# Altium project UPDATE.PrjPcb
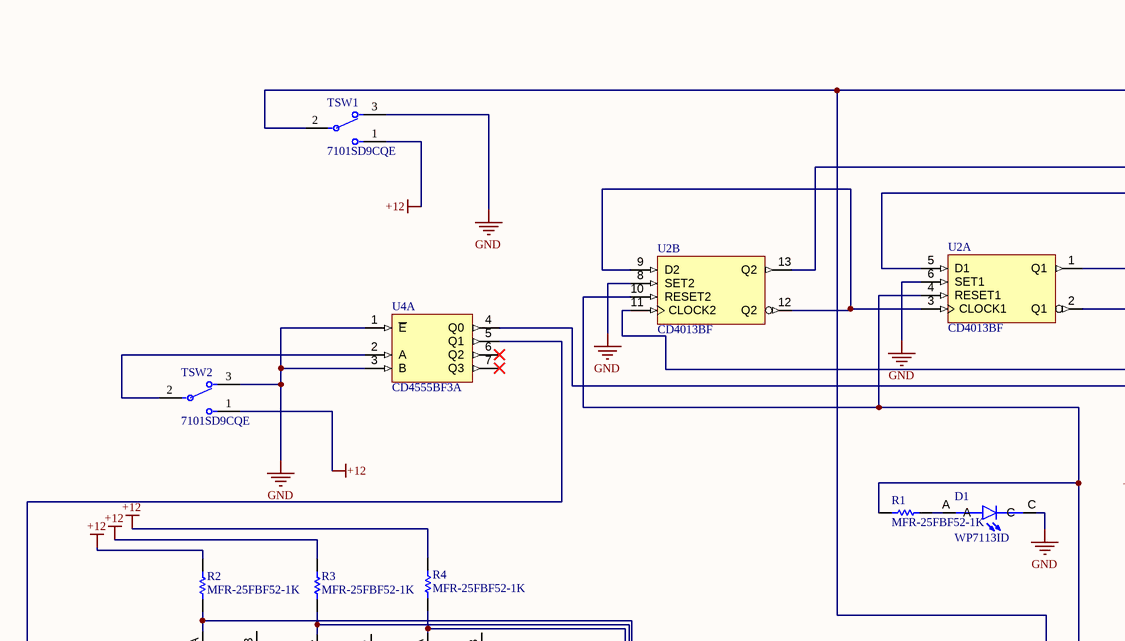
[diagram p0: Sheet2.SchDoc, centre column 2 of 4]
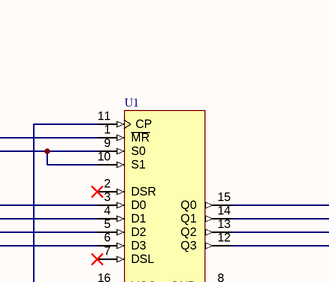
[diagram p1: Sheet2.SchDoc, centre column 3 of 4]
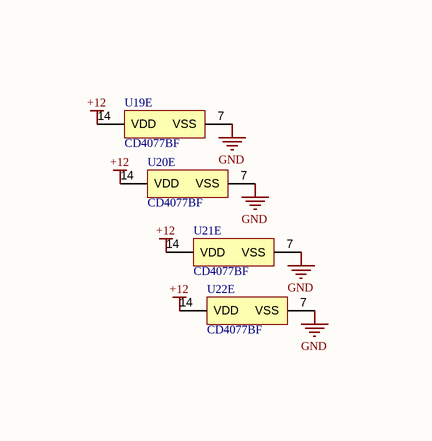
[diagram p2: Sheet2.SchDoc, centre column 4 of 4]
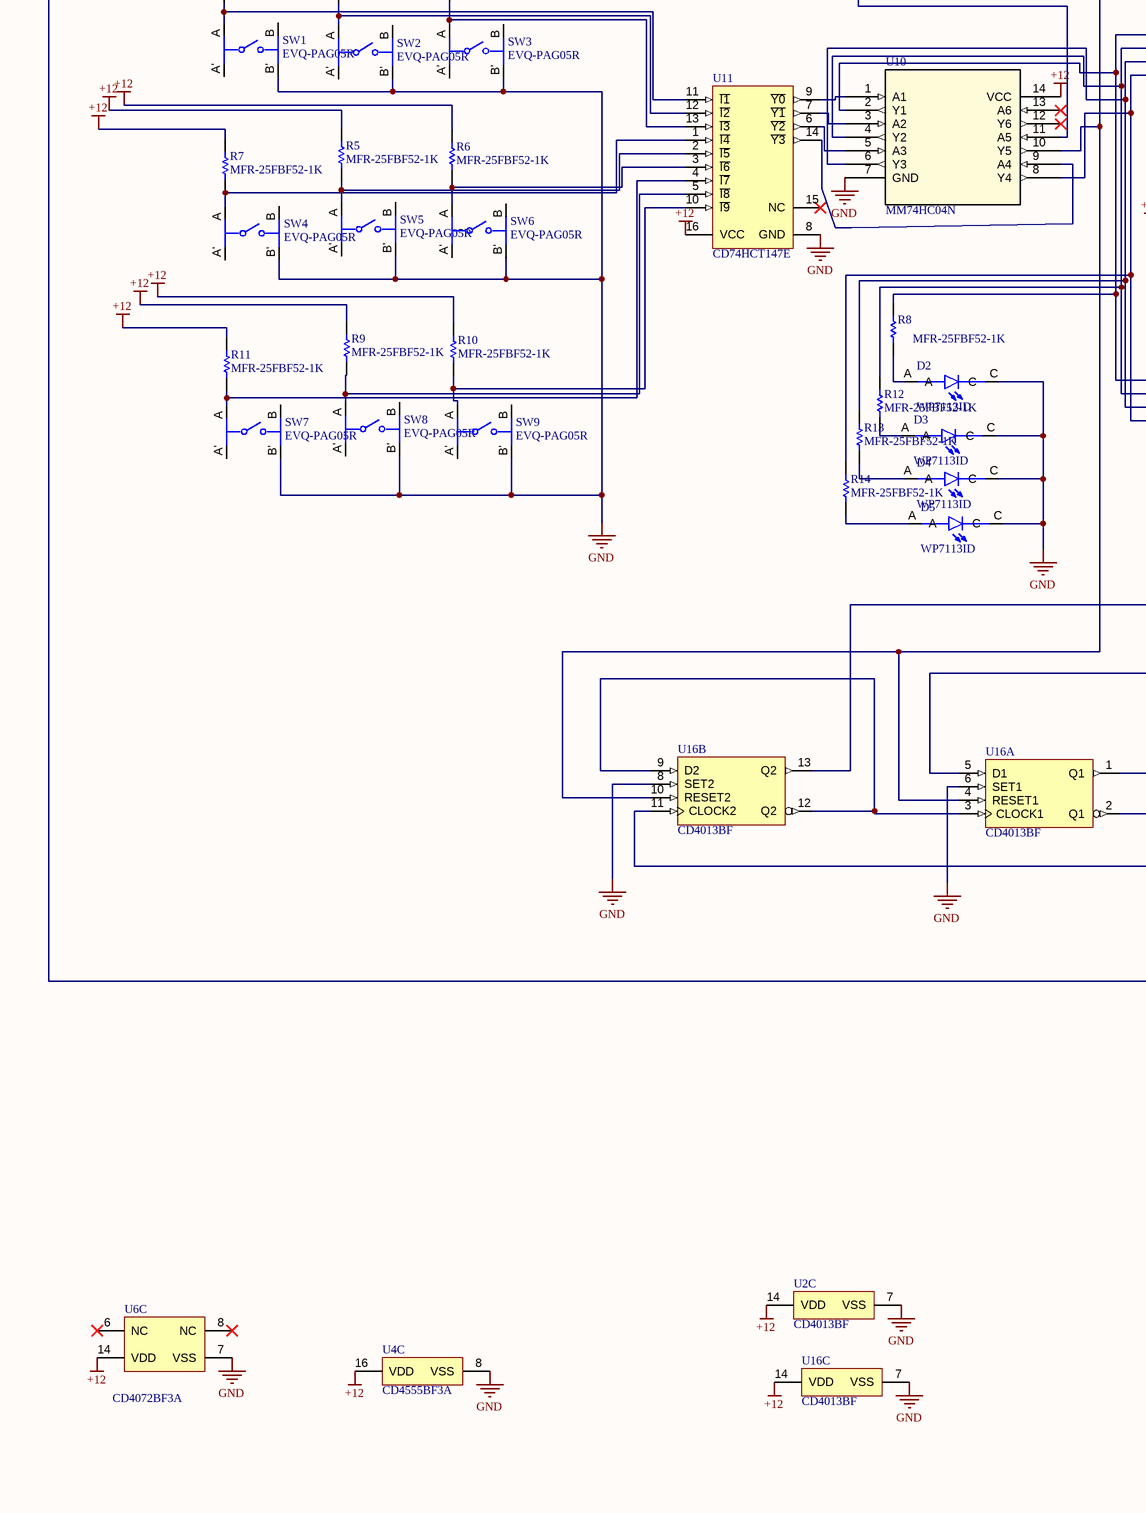
[diagram p3: Sheet2.SchDoc, bottom column 2 of 4]
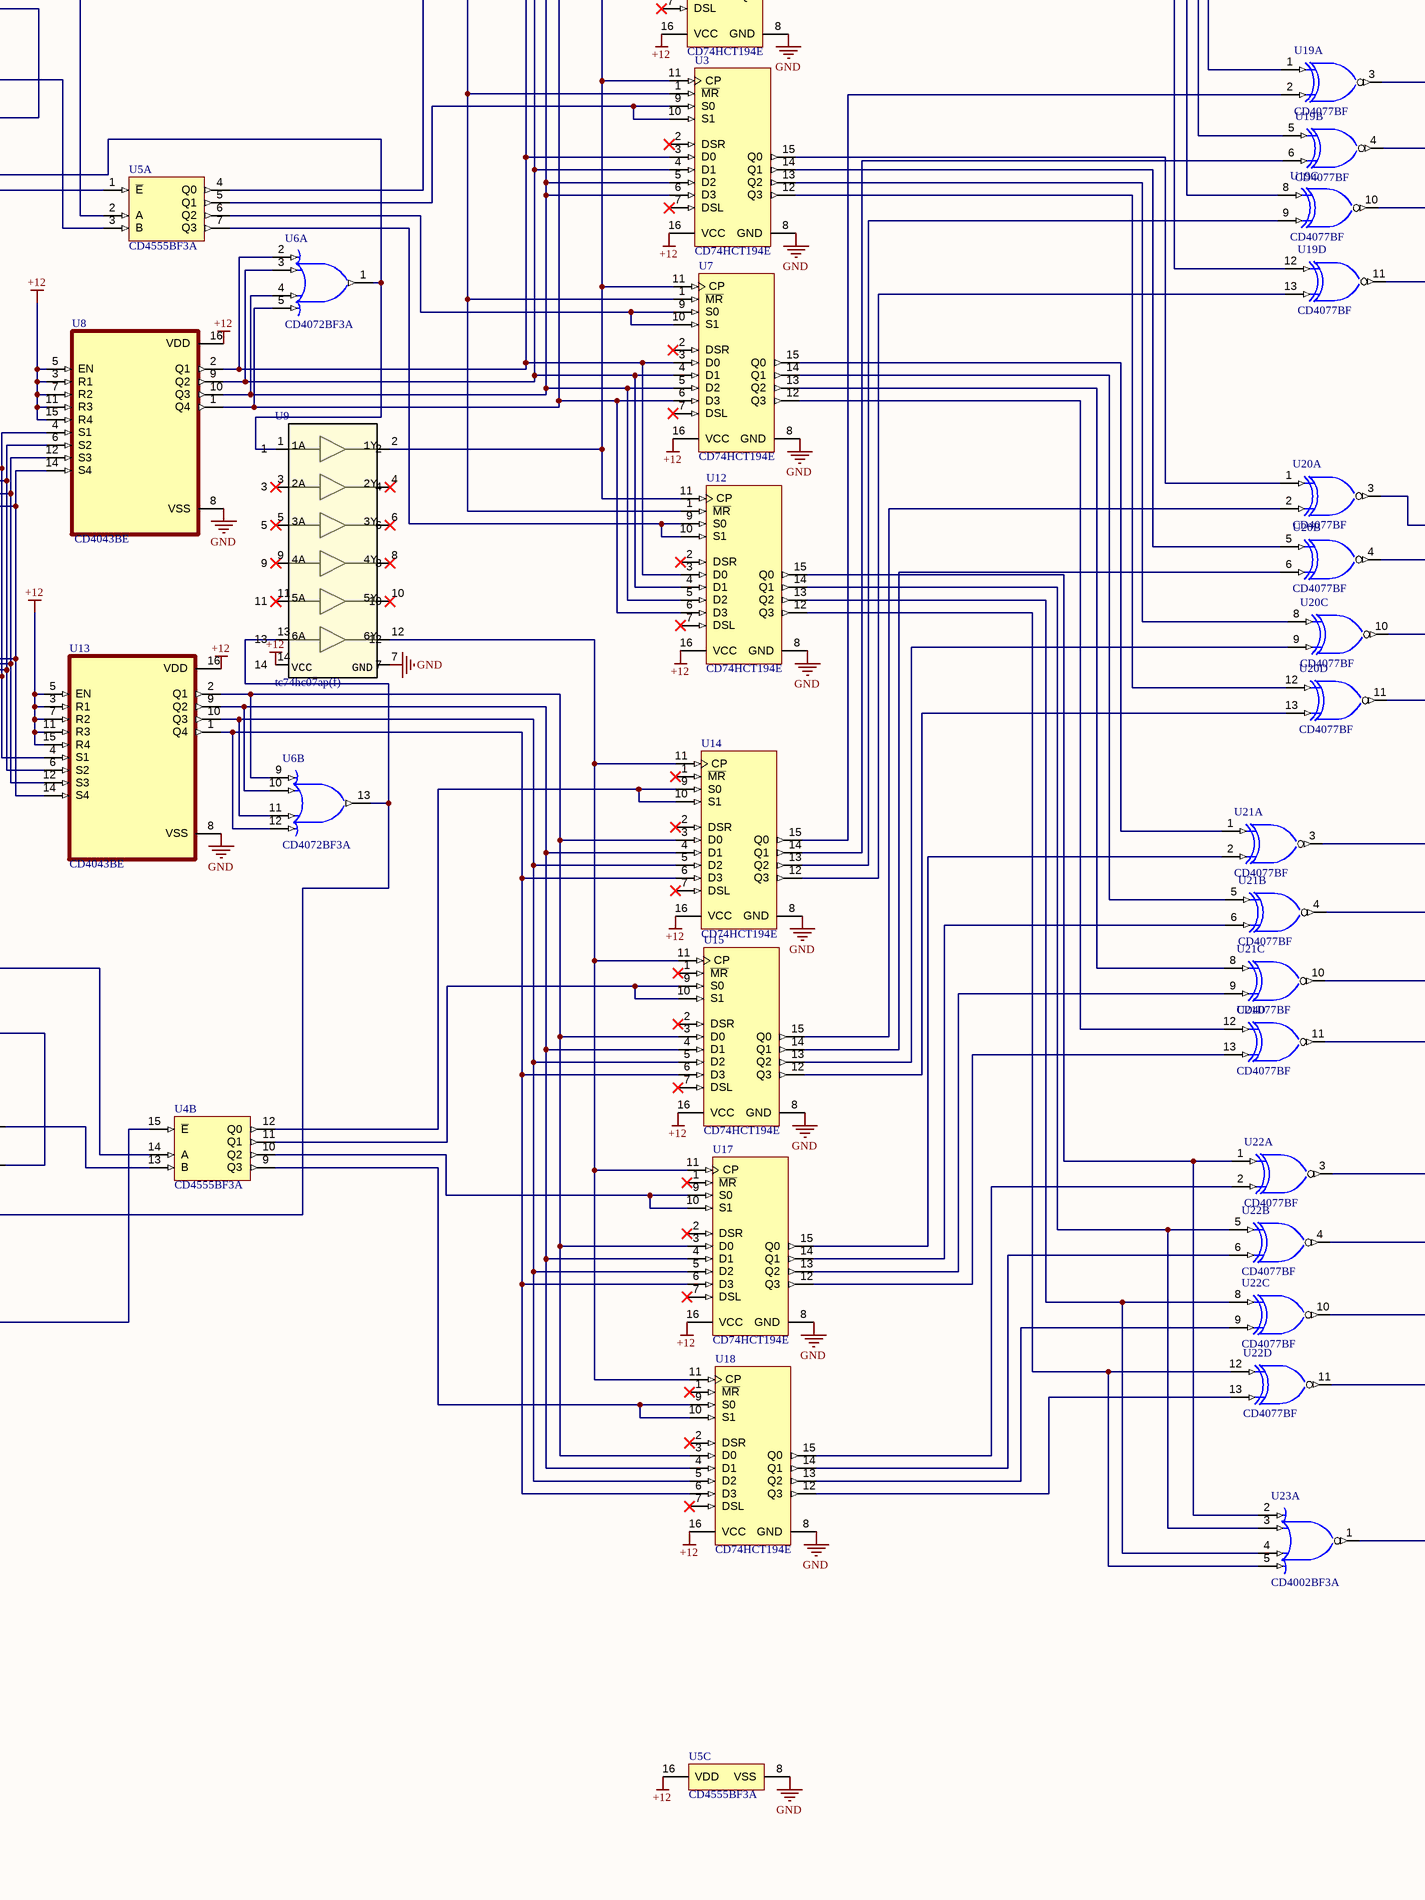
[diagram p4: Sheet2.SchDoc, bottom column 3 of 4]
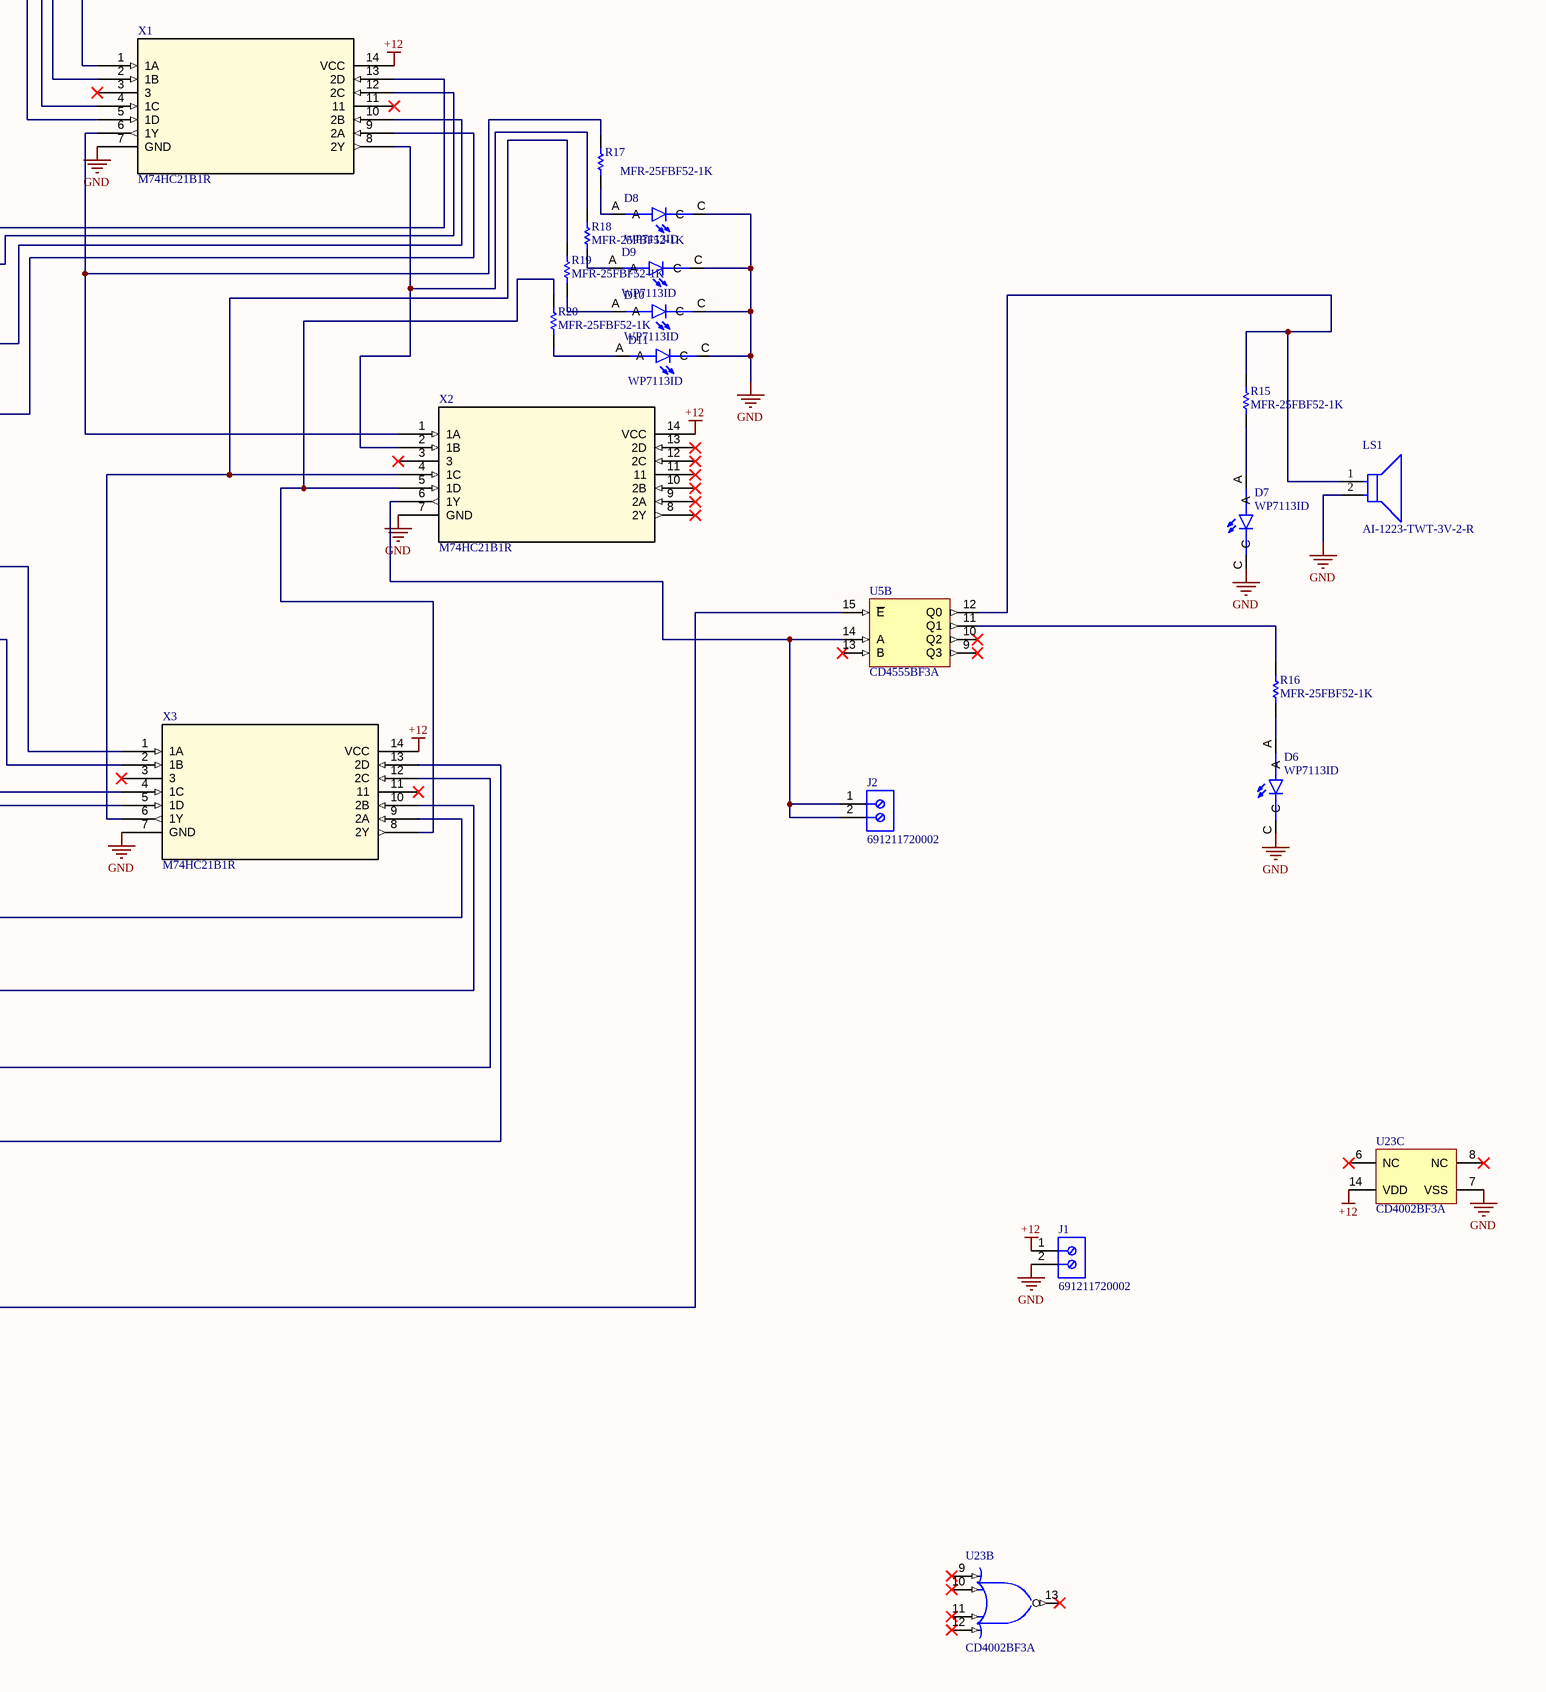
[diagram p5: Sheet2.SchDoc, bottom column 4 of 4]
1 sheet, 71 parts. Net scope: global (net labels, ports and power ports of the same name join across sheets).
Board file: PCB1.PcbDoc

## Sheet Sheet2.SchDoc
size 863 x 558 mm; SheetNumber: 1; SheetTotal: 1

### Parts
D1  WP7113ID  [LED_WP7113ID]
D2  WP7113ID  [LED_WP7113ID]
D3  WP7113ID  [LED_WP7113ID]
D4  WP7113ID  [LED_WP7113ID]
D5  WP7113ID  [LED_WP7113ID]
D6  WP7113ID  [LED_WP7113ID]
D7  WP7113ID  [LED_WP7113ID]
D8  WP7113ID  [LED_WP7113ID]
D9  WP7113ID  [LED_WP7113ID]
D10  WP7113ID  [LED_WP7113ID]
D11  WP7113ID  [LED_WP7113ID]
J1  691211720002  [691211720002]
J2  691211720002  [691211720002]
LS1  AI-1223-TWT-3V-2-R  [FP-AI-1223-TWT-3V-2-R-MFG]
R1  MFR-25FBF52-1K  [RESA60-630X240]
R2  MFR-25FBF52-1K  [RESA60-630X240]
R3  MFR-25FBF52-1K  [RESA60-630X240]
R4  MFR-25FBF52-1K  [RESA60-630X240]
R5  MFR-25FBF52-1K  [RESA60-630X240]
R6  MFR-25FBF52-1K  [RESA60-630X240]
R7  MFR-25FBF52-1K  [RESA60-630X240]
R8  MFR-25FBF52-1K  [RESA60-630X240]
R9  MFR-25FBF52-1K  [RESA60-630X240]
R10  MFR-25FBF52-1K  [RESA60-630X240]
R11  MFR-25FBF52-1K  [RESA60-630X240]
R12  MFR-25FBF52-1K  [RESA60-630X240]
R13  MFR-25FBF52-1K  [RESA60-630X240]
R14  MFR-25FBF52-1K  [RESA60-630X240]
R15  MFR-25FBF52-1K  [RESA60-630X240]
R16  MFR-25FBF52-1K  [RESA60-630X240]
R17  MFR-25FBF52-1K  [RESA60-630X240]
R18  MFR-25FBF52-1K  [RESA60-630X240]
R19  MFR-25FBF52-1K  [RESA60-630X240]
R20  MFR-25FBF52-1K  [RESA60-630X240]
SW1  EVQ-PAG05R  [FP-EVQ-PAG05R-MFG]
SW2  EVQ-PAG05R  [FP-EVQ-PAG05R-MFG]
SW3  EVQ-PAG05R  [FP-EVQ-PAG05R-MFG]
SW4  EVQ-PAG05R  [FP-EVQ-PAG05R-MFG]
SW5  EVQ-PAG05R  [FP-EVQ-PAG05R-MFG]
SW6  EVQ-PAG05R  [FP-EVQ-PAG05R-MFG]
SW7  EVQ-PAG05R  [FP-EVQ-PAG05R-MFG]
SW8  EVQ-PAG05R  [FP-EVQ-PAG05R-MFG]
SW9  EVQ-PAG05R  [FP-EVQ-PAG05R-MFG]
TSW1  7101SD9CQE  [FP-7101SD9CQE-MFG]
TSW2  7101SD9CQE  [FP-7101SD9CQE-MFG]
U1  CD74HCT194E  [N0016A]
U2  CD4013BF  [J0014A]  (parts A,B,C of 3)
U3  CD74HCT194E  [N0016A]
U4  CD4555BF3A  [J0016A]  (parts A,B,C of 3)
U5  CD4555BF3A  [J0016A]  (parts A,B,C of 3)
U6  CD4072BF3A  [J0014A]  (parts A,B,C of 3)
U7  CD74HCT194E  [N0016A]
U8  CD4043BE  [DIP794W45P254L1969H508Q16]
U9  tc74hc07ap(f)  [DIP14_TOS]
U10  MM74HC04N  [PDIP14_19P56X6P35_ONS]
U11  CD74HCT147E  [N0016A]
U12  CD74HCT194E  [N0016A]
U13  CD4043BE  [DIP794W45P254L1969H508Q16]
U14  CD74HCT194E  [N0016A]
U15  CD74HCT194E  [N0016A]
U16  CD4013BF  [J0014A]  (parts A,B,C of 3)
U17  CD74HCT194E  [N0016A]
U18  CD74HCT194E  [N0016A]
U19  CD4077BF  [J0014A]  (parts A,B,C,D,E of 5)
U20  CD4077BF  [J0014A]  (parts A,B,C,D,E of 5)
U21  CD4077BF  [J0014A]  (parts A,B,C,D,E of 5)
U22  CD4077BF  [J0014A]  (parts A,B,C,D,E of 5)
U23  CD4002BF3A  [J0014A]  (parts A,B,C of 3)
X1  M74HC21B1R  [DIP14_300_STH]
X2  M74HC21B1R  [DIP14_300_STH]
X3  M74HC21B1R  [DIP14_300_STH]

### Nets
+12: J1.1 R2.2 R3.2 R4.2 R5.2 R6.2 R7.2 R9.2 R10.2 R11.2 TSW1.1 TSW2.1 U1.16(VCC) U2.14(VDD) U3.16(VCC) U4.16(VDD) U5.16(VDD) U6.14(VDD) U7.16(VCC) U8.3(R1) U8.5(EN) U8.7(R2) U8.11(R3) U8.15(R4) U8.16(VDD) U9.14 U10.14(VCC) U11.16(VCC) U12.16(VCC) U13.3(R1) U13.5(EN) U13.7(R2) U13.11(R3) U13.15(R4) U13.16(VDD) U14.16(VCC) U15.16(VCC) U16.14(VDD) U17.16(VCC) U18.16(VCC) U19.14(VDD) U20.14(VDD) U21.14(VDD) U22.14(VDD) U23.14(VDD) X1.14(VCC) X2.14(VCC) X3.14(VCC)
GND: D1.C D2.C D3.C D4.C D5.C D6.C D7.C D8.C D9.C D10.C D11.C J1.2 LS1.2(A) SW1.B' SW2.B' SW3.B' SW4.B' SW5.B' SW6.B' SW7.B' SW8.B' SW9.B' TSW1.3 TSW2.3 U1.8(GND) U2.6(SET1) U2.7(VSS) U2.8(SET2) U3.8(GND) U4.1(~{E}) U4.3(B) U4.8(VSS) U5.8(VSS) U6.7(VSS) U7.8(GND) U8.8(VSS) U9.7 U10.7(GND) U11.8(GND) U12.8(GND) U13.8(VSS) U14.8(GND) U15.8(GND) U16.6(SET1) U16.7(VSS) U16.8(SET2) U17.8(GND) U18.8(GND) U19.7(VSS) U20.7(VSS) U21.7(VSS) U22.7(VSS) U23.7(VSS) X1.7(GND) X2.7(GND) X3.7(GND)
NetD1_A: D1.A R1.2
NetD2_A: D2.A R8.1
NetD3_A: D3.A R12.1
NetD4_A: D4.A R13.1
NetD5_A: D5.A R14.1
NetD6_A: D6.A R16.1
NetD7_A: D7.A R15.1
NetD8_A: D8.A R17.1
NetD9_A: D9.A R18.1
NetD10_A: D10.A R19.1
NetD11_A: D11.A R20.1
NetJ2_1: J2.1 J2.2 U5.14(A) X2.6(1Y)
NetLS1_1: LS1.1(C) R15.2 U5.12(Q0)
NetR1_1: R1.1 U2.4(RESET1) U2.10(RESET2) U10.10(Y5) U16.4(RESET1) U16.10(RESET2)
NetR2_1: R2.1 SW1.A U11.11(~{I1})
NetR3_1: R3.1 SW2.A U11.12(~{I2})
NetR4_1: R4.1 SW3.A U11.13(~{I3})
NetR5_1: R5.1 SW5.A U11.2(~{I5})
NetR6_1: R6.1 SW6.A U11.3(~{I6})
NetR7_1: R7.1 SW4.A U11.1(~{I4})
NetR8_2: R8.2 U8.4(S1) U10.2(Y1) U13.4(S1)
NetR9_1: R9.1 SW8.A U11.5(~{I8})
NetR10_1: R10.1 SW9.A U11.10(~{I9})
NetR11_1: R11.1 SW7.A U11.4(~{I7})
NetR12_2: R12.2 U8.6(S2) U10.4(Y2) U13.6(S2)
NetR13_2: R13.2 U8.12(S3) U10.6(Y3) U13.12(S3)
NetR14_2: R14.2 U8.14(S4) U10.8(Y4) U13.14(S4)
NetR16_2: R16.2 U5.11(Q1)
NetR17_2: R17.2 X1.6(1Y) X2.1(1A)
NetR18_2: R18.2 X1.8(2Y) X2.2(1B)
NetR19_2: R19.2 X2.4(1C) X3.6(1Y)
NetR20_2: R20.2 X2.5(1D) X3.8(2Y)
NetTSW1_2: TSW1.2(COMM) U1.1(~{MR}) U3.1(~{MR}) U7.1(~{MR}) U10.11(A5) U12.1(~{MR})
NetTSW2_2: TSW2.2(COMM) U4.2(A)
NetU1_3: U1.3(D0) U3.3(D0) U6.2(A) U7.3(D0) U8.2(Q1) U12.3(D0)
NetU1_4: U1.4(D1) U3.4(D1) U6.3(B) U7.4(D1) U8.9(Q2) U12.4(D1)
NetU1_5: U1.5(D2) U3.5(D2) U3.6(D3) U6.4(C) U7.5(D2) U8.10(Q3) U12.5(D2)
NetU1_6: U1.6(D3) U6.5(D) U7.6(D3) U8.1(Q4) U12.6(D3)
NetU1_9: U1.9(S0) U1.10(S1) U5.4(Q0)
NetU1_11: U1.11(CP) U3.11(CP) U7.11(CP) U9.2 U12.11(CP)
NetU1_12: U1.12(Q3) U19.12(G)
NetU1_13: U1.13(Q2) U19.8(E)
NetU1_14: U1.14(Q1) U19.5(C)
NetU1_15: U1.15(Q0) U19.1(A)
NetU2_1: U2.1(Q1) U5.3(B)
NetU2_2: U2.2(Q1) U2.5(D1)
NetU2_3: U2.3(CLOCK1) U2.9(D2) U2.12(Q2)
NetU2_11: U2.11(CLOCK2) U6.1(J) U9.1
NetU2_13: U2.13(Q2) U5.2(A)
NetU3_9: U3.9(S0) U3.10(S1) U5.5(Q1)
NetU3_12: U3.12(Q3) U20.12(G)
NetU3_13: U3.13(Q2) U20.8(E)
NetU3_14: U3.14(Q1) U20.5(C)
NetU3_15: U3.15(Q0) U20.1(A)
NetU4_4: U4.4(Q0) U5.1(~{E})
NetU4_5: U4.5(Q1) U4.15(~{E})
NetU4_9: U4.9(Q3) U18.9(S0) U18.10(S1)
NetU4_10: U4.10(Q2) U17.9(S0) U17.10(S1)
NetU4_11: U4.11(Q1) U15.9(S0) U15.10(S1)
NetU4_12: U4.12(Q0) U14.9(S0) U14.10(S1)
NetU4_13: U4.13(B) U16.1(Q1)
NetU4_14: U4.14(A) U16.13(Q2)
NetU5_6: U5.6(Q2) U7.9(S0) U7.10(S1)
NetU5_7: U5.7(Q3) U12.9(S0) U12.10(S1)
NetU5_15: U5.15(~{E}) U23.1(J)
NetU6_9: U6.9(E) U13.2(Q1) U14.3(D0) U15.3(D0) U17.3(D0) U18.3(D0)
NetU6_10: U6.10(F) U13.9(Q2) U14.4(D1) U15.4(D1) U17.4(D1) U18.4(D1)
NetU6_11: U6.11(G) U13.10(Q3) U14.5(D2) U15.5(D2) U17.5(D2) U18.5(D2)
NetU6_12: U6.12(H) U13.1(Q4) U14.6(D3) U15.6(D3) U17.6(D3) U18.6(D3)
NetU6_13: U6.13(K) U9.13 U16.11(CLOCK2)
NetU7_12: U7.12(Q3) U21.12(G)
NetU7_13: U7.13(Q2) U21.8(E)
NetU7_14: U7.14(Q1) U21.5(C)
NetU7_15: U7.15(Q0) U21.1(A)
NetU9_12: U9.12 U14.11(CP) U15.11(CP) U17.11(CP) U18.11(CP)
NetU10_1: U10.1(A1) U11.9(~{Y0})
NetU10_3: U10.3(A2) U11.7(~{Y1})
NetU10_5: U10.5(A3) U11.6(~{Y2})
NetU10_9: U10.9(A4) U11.14(~{Y3})
NetU12_12: U12.12(Q3) U22.12(G) U23.5(D)
NetU12_13: U12.13(Q2) U22.8(E) U23.4(C)
NetU12_14: U12.14(Q1) U22.5(C) U23.3(B)
NetU12_15: U12.15(Q0) U22.1(A) U23.2(A)
NetU14_12: U14.12(Q3) U19.13(H)
NetU14_13: U14.13(Q2) U19.9(F)
NetU14_14: U14.14(Q1) U19.6(D)
NetU14_15: U14.15(Q0) U19.2(B)
NetU15_12: U15.12(Q3) U20.13(H)
NetU15_13: U15.13(Q2) U20.9(F)
NetU15_14: U15.14(Q1) U20.6(D)
NetU15_15: U15.15(Q0) U20.2(B)
NetU16_2: U16.2(Q1) U16.5(D1)
NetU16_3: U16.3(CLOCK1) U16.9(D2) U16.12(Q2)
NetU17_12: U17.12(Q3) U21.13(H)
NetU17_13: U17.13(Q2) U21.9(F)
NetU17_14: U17.14(Q1) U21.6(D)
NetU17_15: U17.15(Q0) U21.2(B)
NetU18_12: U18.12(Q3) U22.13(H)
NetU18_13: U18.13(Q2) U22.9(F)
NetU18_14: U18.14(Q1) U22.6(D)
NetU18_15: U18.15(Q0) U22.2(B)
NetU19_3: U19.3(J) X1.1(1A)
NetU19_4: U19.4(K) X1.2(1B)
NetU19_10: U19.10(L) X1.4(1C)
NetU19_11: U19.11(M) X1.5(1D)
NetU20_3: U20.3(J) X1.13(2D)
NetU20_4: U20.4(K) X1.12(2C)
NetU20_10: U20.10(L) X1.10(2B)
NetU20_11: U20.11(M) X1.9(2A)
NetU21_3: U21.3(J) X3.1(1A)
NetU21_4: U21.4(K) X3.2(1B)
NetU21_10: U21.10(L) X3.4(1C)
NetU21_11: U21.11(M) X3.5(1D)
NetU22_3: U22.3(J) X3.9(2A)
NetU22_4: U22.4(K) X3.10(2B)
NetU22_10: U22.10(L) X3.12(2C)
NetU22_11: U22.11(M) X3.13(2D)

Not connected (* = marked no-connect by the designer): SW1 A' B; SW2 A' B; SW3 A' B; SW4 A' B; SW5 A' B; SW6 A' B; SW7 A' B; SW8 A' B; SW9 A' B; U1 2(DSR)* 7(DSL)*; U3 2(DSR)* 7(DSL)*; U4 6(Q2)* 7(Q3)*; U5 9(Q3)* 10(Q2)* 13(B)*; U6 6(NC)* 8(NC)*; U7 2(DSR)* 7(DSL)*; U9 3* 4* 5* 6* 8* 9* 10* 11*; U10 12(Y6)* 13(A6)*; U11 15(NC)*; U12 2(DSR)* 7(DSL)*; U14 1(~{MR})* 2(DSR)* 7(DSL)*; U15 1(~{MR})* 2(DSR)* 7(DSL)*; U17 1(~{MR})* 2(DSR)* 7(DSL)*; U18 1(~{MR})* 2(DSR)* 7(DSL)*; U23 6(NC)* 8(NC)* 9(E)* 10(F)* 11(G)* 12(H)* 13(K)*; X1 3* 11*; X2 3* 8(2Y)* 9(2A)* 10(2B)* 11* 12(2C)* 13(2D)*; X3 3* 11*

### Notes on the sheet
- DWG. NO.
- REV.
- SHT.
- REVISION
- DESCRIPTION
- DATE
- APPROVED
- THIS DOCUMENT AND THE DATA DISCLOSED HEREIN OR HEREWITH IS THE PROPERTY OF ALTIUM LIMITED AND MAY BE FREELY DISTRIBUTED IN WHOLE. NO RIGHTS ARE RESERVED OR EXPRESS OR IMPLIED WARANTEE GIVEN.
- ENG:
- DSN:
- APPROVALS
- PROJECT
- DOCUMENT REVISION:
- DESIGN ITEM:
- CHK:
- BOM:
- REFERENCE DOCUMENTS
- PROJECT REVISION:
- TITLE
- FAB DWG:
- PCB DWG:
- ASSY DWG:
- SCALE:
- SIZE
- D
- CAGE CODE
- FILE NAME
- DWG NO.
- SHEET
- OF
- REV
- (in symbol tc74hc07apf) 1A; 1Y; 2A; 2Y; 3A; 3Y; 4A; 4Y; 5A; 5Y; 6A; 6Y; VCC; GND

### Library data of the parts
D1-D11 = WP7113ID: Red 617nm LED Indication - Discrete 2V Radial; MF: Kingbright; Price: None; MP: WP7113ID; Package: Radial Kingbright; Check_prices: https://www.snapeda.com/parts/WP7113ID/Kingbright/view-part/?ref=eda; Purchase-URL: https://pricing.snapeda.com/search/part/WP7113ID/?ref=eda; Availability: In Stock; Value: *; SnapEDA_Link: https://www.snapeda.com/parts/WP7113ID/Kingbright/view-part/?ref=snap
J1 J2 = CMP-1502-02524-3: 211 Series 5MM Pitch Straight, Pcb Terminal Block, Through Hole, 2 Way; Number of Levels: 1; Current: 10A; Voltage: 300V; Pitch: 5.0038mm; Wire Gauge (Min): 12AWG; Connector Type: PCB, Terminal Block; Number of Positions Per Level: 2; Plating: Brass, Steel; Wire Gauge (Max): 24AWG; Stripping Length: -7mm; Termination: Screw; Height: 15.5mm; Contact Plating: Tin; REACH SVHC: Unknown; Contact Material: Brass; Width: 10mm; RoHS: Compliant; Number of Pins: 2; Lead Pitch: 5mm; Mount: Through Hole; Min Operating Temperature: -40°C; Length: 13.7mm; Number of Contacts: 2; Color: Green; Wire/Cable Gauge: 12AWG; Housing Material: Nylon; Packaging: Box; Max Operating Temperature: 105°C
LS1 = CMP-103888-000003-1: BUZZER MAGNETIC 3V 12MM TH; Min Supply Voltage (DC): 2V; Operating Supply Current: 30mA; Max Supply Voltage (DC): 4V; Input Type: DC; Frequency: 2.3kHz; Series: AI; Nominal Supply Voltage (DC): 3V; Packaging: Tray; Max Operating Temperature: 70°C; Height: 7.5mm; Termination: PC Pins; Max Supply Current: 30mA; Mount: Through Hole; Diameter: 12mm; Voltage Rating: 3V; Sensing Method: Magnetic; Min Operating Temperature: -20°C; Contact Plating: Tin
R1-R20 = CMP-1659-00075-1: Axial Resistor, 1 KOhm, +/- 1%, 250 mW, -55 to 155 degC, 2-Pin THD, RoHS, Bulk; Voltage Rating: 250 V; Resistance: 10 kohm; Power Rating: 250 mW; ComponentLink2Description: Datasheet; RoHSCompliant: true; PackageReference: MFR-25; Case\Package: Axial; Max Operating Temperature: 155 degC; DatasheetVersion: Apr-13; Tolerance: 1%; ComponentLink1URL: http://www.yageo.com/; Length: 0.248 inch; ComponentLink2URL: http://www.yageo.com/documents/recent/Yageo%20LR_MFR_2013.pdf; Packaging: Bulk; Package Quantity: 200; PackageDescription: 2-Pin Axial Lead, Dia 2.4 mm, Body Length 6.3 mm; Min Operating Temperature: -55 degC; ComponentLink1Description: Manufacturer URL
SW1-SW9 = CMP-05618-000039-1: SWITCH TACTILE SPST-NO 0.02A 15V; Electrical Life: 50000Cycles; Actuator Color: Red; Switch Function: Off-Mom; Actuator Type: Standard; Max Current Rating: 20mA; Contact Resistance: 50mR; Operating Force: 2.6N; Switch Travel: 0.25mm; Illumination Type: Non-Illuminated; Throw Configuration: SPST; Actuator Length: 1.6mm; Max Operating Temperature: 70°C; Mount: Through Hole; RoHS Compliant: Yes; Depth: 6.5mm; Radiation Hardening: No; Orientation: Straight; Width: 6mm; REACH SVHC: No SVHC; Voltage Rating (DC): 15V; Package Quantity: 500; Size: 6mm; Max Voltage Rating (DC): 15V; Mechanical Life: 50000Cycles; Contact Current Rating: 20mA; Contact Plating: Silver; Lead Free: Lead Free; Series: EVQPA; Height: 5mm; Length: 6mm; Min Operating Temperature: -20°C; Current Rating: 20mA; Termination: PC Pin; Packaging: Bulk
TSW1 TSW2 = CMP-01151-55410166-1: 7101SD9CQE Toggle Switch, Spdt, On-On, Maintained, 5A, 28Vdc, 3 Pcb Hole Cnt, Solder Terminal, Toggle; Voltage Rating (AC): 120V; Max Voltage Rating (DC): 28V; Illumination Type: Illuminated, Non-Illuminated; Contact Resistance: 10mΩ; Actuator Material: Brass, Chrome; Life (Cycles): 100kcycles; Max Voltage Rating (AC): 250V; Actuator Length: 12.45mm; Max Current Rating: 5A; Contact Current Rating: 5A; Termination: PC Pins; Min Operating Temperature: -30°C; Depth: 6.86mm; Orientation: Straight; Voltage Rating (DC): 28V; Length: 12.7mm; RoHS: Compliant; Housing Material: Stainless Steel; Contact Material: Silver; Contact Plating: Silver; Radiation Hardening: No; Current Rating: 5A; Lead Free: Lead Free; Switch Function: On-On; Mount: Through Hole; Electrical Life: 100kcycles; Throw Configuration: SPDT; Max Operating Temperature: 85°C; NexarPartId: 55410166
U1 U3 U7 U12 U14 U15 U17 U18 = CMP-0807-00167-3: High Speed CMOS Logic 4-Bit Bidirectional Universal Shift Register, N0016A, TUBE; Manufacturer: Texas Instruments; Input Type: TTL; VCC(Min)(V): 4.5; VCC(Max)(V): 5.5; ICC @ Nom Voltage(Max)(mA): 0.08; F @ Nom Voltage(Max)(Mhz): 25; Rating: Catalog; tpd @ Nom Voltage(Max)(ns): 46; 3-State Output: No; Voltage(Nom)(V): 5; Output Drive (IOL/IOH)(Max)(mA): 4/-4; Bits: 8; Technology Family: HCT; Code_JEDEC: MS-001; Generic Part Number: CD74HCT194; PackageVersion: http://www.ti.com/lit/ml/mpdi002c/mpdi002c.pdf; Output Type: CMOS; DatasheetVersion: SCHS164G; PackageReference: N0016A; Operating Temperature Range(C): -55 to 125
U2 U16 = CMP-1616-00070-3: CMOS Dual D-Type Flip Flop, J0014A, TUBE; Generic Part Number: CD4013B-MIL; Manufacturer: Texas Instruments; tpd @ Nom Voltage(Max)(ns): 130; Output Logic: Inverted,Non-inverted; Rating: Military; 3-State Output: No; VCC(Max)(V): 18; Voltage(Nom)(V): 10; ICC @ Nom Voltage(Max)(mA): 0.06; VCC(Min)(V): 3; Bits(#): 2; Output Drive (IOL/IOH)(Max)(mA): 1.5/-1.5; Technology Family: CD4000; F @ Nom Voltage(Max)(Mhz): 8; DatasheetVersion: SCHS023D; Input Type: CMOS; Operating Temperature Range(C): -55 to 125; PackageReference: J0014A; Schmitt Trigger: No; Output Type: CMOS
U4 U5 = CMP-1633-00451-2: CMOS Dual Binary to 1-of-4 Decoder/Demultiplexer with Outputs High on Select, J0016A, TUBE; Manufacturer: Texas Instruments; Generic Part Number: CD4555B-MIL; Technology Family: CD4000; F @ Nom Voltage(Max)(Mhz): 8; Voltage(Nom)(V): 10; Rating: Military; VCC(Max)(V): 18; Output Drive (IOL/IOH)(Max)(mA): 1.5/-1.5; Schmitt Trigger: No; VCC(Min)(V): 3; tpd @ Nom Voltage(Max)(ns): 190; Channels(#): 2; ICC @ Nom Voltage(Max)(mA): 0.3; PackageReference: J0016A; DatasheetVersion: SCHS087D; Input Type: CMOS; Operating Temperature Range(C): -55 to 125; Output Type: CMOS
U6 = CMP-1573-00121-3: CMOS Dual 4-Input OR Gate, J0014A, TUBE; Generic Part Number: CD4072B-MIL; Manufacturer: Texas Instruments; tpd @ Nom Voltage(Max)(ns): 250; Bits(#): 2; VCC(Min)(V): 3; Voltage(Nom)(V): 10; VCC(Max)(V): 18; F @ Nom Voltage(Max)(Mhz): 8; Rating: Military; ICC @ Nom Voltage(Max)(mA): 0.015; Output Drive (IOL/IOH)(Max)(mA): 1.5/-1.5; DatasheetVersion: SCHS056D; PackageReference: J0014A; Output Type: CMOS; Input Type: CMOS; PackageVersion: http://www.ti.com/lit/ml/mcer002d/mcer002d.pdf; Operating Temperature Range(C): -55 to 125
U8 U13 = CD4043BE: CMOS Quad NOR R/S Latch with 3-State Outputs; MF: Texas Instruments; SnapEDA_Link: https://www.snapeda.com/parts/CD4043BE/Texas+Instruments/view-part/?ref=snap; Package: PDIP-16 Texas Instruments; Value: *; MP: CD4043BE; Check_prices: https://www.snapeda.com/parts/CD4043BE/Texas+Instruments/view-part/?ref=eda
U9 = tc74hc07apf: Hex Buffer, DIP14; Manufacturer_Name: Toshiba Electronic Devices & Storage Corp.; Number_devices_in_Package: 1; Copyright: Copyright (C) 2025 Ultra Librarian. All rights reserved.; Manufacturer_Part_Number: tc74hc07ap(f); Source_Package: TC74HC07AP; RefDes: Refdes; Type: Type
U10 = MM74HC04N: Description; Manufacturer_Name: onsemi; Copyright: Copyright (C) 2026 Ultra Librarian. All rights reserved.; Manufacturer_Part_Number: MM74HC04N; RefDes: RefDes; Type: Type
U11 = CMP-1633-00685-2: High Speed CMOS Logic 10-to-4 Line Priority Encoder, N0016A, TUBE; Manufacturer: Texas Instruments; Bits(#): 10; F @ Nom Voltage(Max)(Mhz): 25; Technology Family: HCT; tpd @ Nom Voltage(Max)(ns): 35; ICC @ Nom Voltage(Max)(mA): 0.08; Output Drive (IOL/IOH)(Max)(mA): 4/-4; Rating: Catalog; VCC(Max)(V): 5.5; Function: Encoder/Multiplexer; Input Type: TTL; Configuration: 10：4; VCC(Min)(V): 4.5; Voltage(Nom)(V): 5; Schmitt Trigger: No; Channels(#): 1; Output Type: CMOS; Operating Temperature Range(C): -55 to 125; PackageReference: N0016A; Code_JEDEC: MS-001; Generic Part Number: CD74HCT147; DatasheetVersion: SCHS149F; Type: Standard
U19-U22 = CMP-1579-00012-3: CMOS Quad Exclusive-NOR Gate, J0014A, TUBE; Manufacturer: Texas Instruments; Generic Part Number: CD4077B-MIL; ICC @ Nom Voltage(Max)(mA): 0.015; Technology Family: CD4000; Voltage(Nom)(V): 10; Bits(#): 4; VCC(Min)(V): 3; Output Drive(mA): -6.8/6.8; Rating: Military; tpd @ Nom Voltage(Max)(ns): 130; VCC(Max)(V): 18; F @ Nom Voltage(Max)(Mhz): 9; Schmitt Trigger: No; Input Type: CMOS; PackageReference: J0014A; Operating Temperature Range(C): -55 to 125; Output Type: CMOS; DatasheetVersion: SCHS055E
U23 = CMP-0806-00145-3: CMOS Dual 4-Input NOR Gate, J0014A, TUBE; Manufacturer: Texas Instruments; Generic Part Number: CD4002B-MIL; VCC(Max)(V): 18; ICC @ Nom Voltage(Max)(mA): 0.015; Voltage(Nom)(V): 10; VCC(Min)(V): 3; F @ Nom Voltage(Max)(Mhz): 8; Bits(#): 2; tpd @ Nom Voltage(Max)(ns): 250; Rating: Military; Output Drive (IOL/IOH)(Max)(mA): 1.5/-1.5; Input Type: CMOS; PackageReference: J0014A; Output Type: CMOS; Operating Temperature Range(C): -55 to 125; DatasheetVersion: SCHS015C; PackageVersion: http://www.ti.com/lit/ml/mcer002d/mcer002d.pdf
X1-X3 = M74HC21B1R: No Description Available; Manufacturer_Name: STMicroelectronics; Copyright: Copyright (C) 2026 Ultra Librarian. All rights reserved.; Manufacturer_Part_Number: M74HC21B1R; RefDes: RefDes; Type: Type